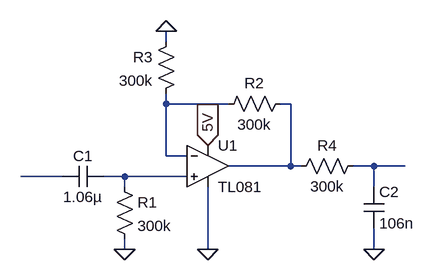
[diagram p0: schematic BPF.asc]
BPF.asc, the LTspice schematic file:
Version 4
SHEET 1 880 680
WIRE 112 -48 112 -64
WIRE 112 48 112 32
WIRE 208 48 112 48
WIRE 304 48 288 48
WIRE 112 128 112 48
WIRE 144 128 112 128
WIRE 304 144 304 48
WIRE 304 144 208 144
WIRE 320 144 304 144
WIRE 432 144 400 144
WIRE 480 144 432 144
WIRE -48 160 -112 160
WIRE 48 160 16 160
WIRE 144 160 48 160
WIRE 48 176 48 160
WIRE 432 176 432 144
WIRE 48 272 48 256
WIRE 176 272 176 176
WIRE 432 272 432 240
FLAG 176 272 0
FLAG 112 -64 0
FLAG 176 112 5V
IOPIN 176 112 In
FLAG 432 272 0
FLAG 48 272 0
SYMBOL res 32 160 R0
SYMATTR InstName R1
SYMATTR Value 300k
SYMBOL cap 16 144 R90
WINDOW 0 0 32 VBottom 2
WINDOW 3 32 32 VTop 2
SYMATTR InstName C1
SYMATTR Value 1.06µ
SYMBOL Opamps\\opamp2 176 80 R0
SYMATTR InstName U1
SYMATTR Value TL081
SYMBOL res 304 32 R90
WINDOW 0 0 56 VBottom 2
WINDOW 3 32 56 VTop 2
SYMATTR InstName R2
SYMATTR Value 300k
SYMBOL res 128 -64 M0
SYMATTR InstName R3
SYMATTR Value 300k
SYMBOL res 416 128 R90
WINDOW 0 0 56 VBottom 2
WINDOW 3 32 56 VTop 2
SYMATTR InstName R4
SYMATTR Value 300k
SYMBOL cap 416 176 R0
SYMATTR InstName C2
SYMATTR Value 106n

The netlist it stands for:
* BPF.asc
R1 N005 0 300k
C1 N005 N004 1.06µ
XU1 N005 N001 5V 0 N002 TL081  ; pins In+ In- V+ V- OUT
R2 N002 N001 300k
R3 0 N001 300k
R4 N003 N002 300k
C2 N003 0 106n
.backanno
.end